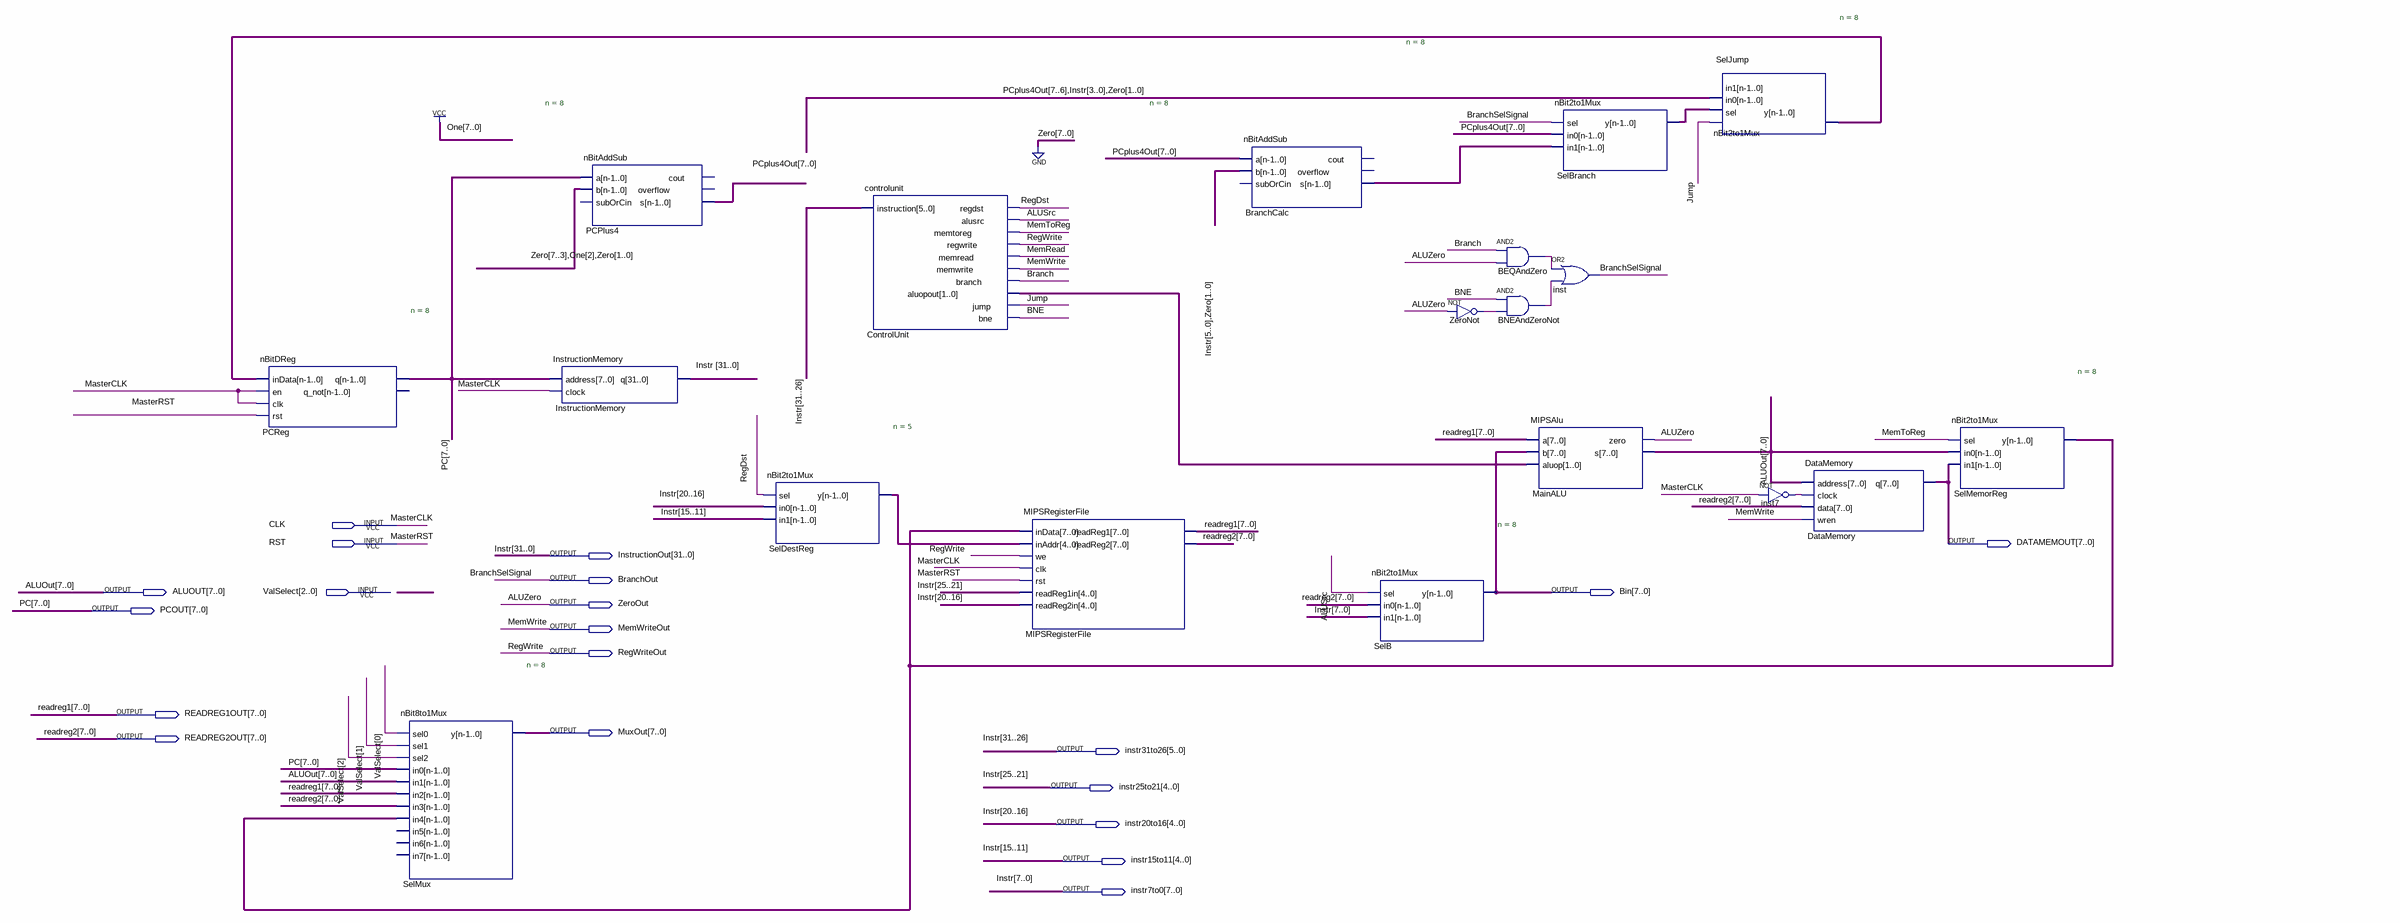
[diagram p0: schematic sheet]
// Quartus schematic TopLevelEntity.bdf as structural Verilog: 19 symbols, 20 pins
module TopLevelEntity (
  input  CLK,
  input  RST,
  input  [2:0] ValSelect,
  output [7:0] DATAMEMOUT,
  output [31:0] InstructionOut,
  output BranchOut,
  output [7:0] ALUOUT,
  output [7:0] Bin,
  output ZeroOut,
  output [7:0] PCOUT,
  output MemWriteOut,
  output RegWriteOut,
  output [7:0] READREG1OUT,
  output [7:0] MuxOut,
  output [7:0] READREG2OUT,
  output [5:0] instr31to26,
  output [4:0] instr25to21,
  output [4:0] instr20to16,
  output [4:0] instr15to11,
  output [7:0] instr7to0
);

  wire ALUSrc, BEQAndZero_out, BNE, BNEAndZeroNot_out, Branch, inst7_out, Jump, MemRead, MemToReg, RegDst,
       ZeroNot_out;
  wire [1:0] ControlUnit_aluopout;
  wire [4:0] SelDestReg_y;
  wire [7:0] BranchCalc_s, PCplus4Out, SelBranch_y, SelJump_y, SelMemorReg_y;

  nBitDReg #(.n(8)) PCReg (.inData(SelJump_y), .en(CLK), .clk(CLK), .rst(RST), .q(PCOUT));  // open: q_not
  nBit8to1Mux #(.n(8)) SelMux (
    .sel0(ValSelect[0]), .sel1(ValSelect[1]), .sel2(ValSelect[2]), .in0(PCOUT), .in1(ALUOUT),
    .in2(READREG1OUT), .in3(READREG2OUT), .in4(SelMemorReg_y), .y(MuxOut));  // open: in5, in6, in7
  InstructionMemory InstructionMemory (
    .address(PCOUT), .clock(CLK),
    .q({instr31to26, instr25to21, instr20to16, instr15to11, InstructionOut[10:8], instr7to0}));
  nBitAddSub #(.n(8)) PCPlus4 (.a(PCOUT), .b(8'b00000100), .s(PCplus4Out));  // open: subOrCin, cout, overflow
  nBit2to1Mux #(.n(5)) SelDestReg (.sel(RegDst), .in0(instr20to16), .in1(instr15to11), .y(SelDestReg_y));
  controlunit ControlUnit (
    .instruction(instr31to26), .regdst(RegDst), .alusrc(ALUSrc), .memtoreg(MemToReg), .regwrite(RegWriteOut),
    .memread(MemRead), .memwrite(MemWriteOut), .branch(Branch), .aluopout(ControlUnit_aluopout), .jump(Jump),
    .bne(BNE));
  MIPSRegisterFile MIPSRegisterFile (
    .inData(SelMemorReg_y), .inAddr(SelDestReg_y), .we(RegWriteOut), .clk(CLK), .rst(RST),
    .readReg1in(instr25to21), .readReg2in(instr20to16), .readReg1(READREG1OUT), .readReg2(READREG2OUT));
  nBitAddSub #(.n(8)) BranchCalc (
    .a(PCplus4Out), .b({instr7to0[5:0], 2'b00}), .s(BranchCalc_s));  // open: subOrCin, cout, overflow
  nBit2to1Mux #(.n(8)) SelB (.sel(ALUSrc), .in0(READREG2OUT), .in1(instr7to0), .y(Bin));
  not ZeroNot (ZeroNot_out, ZeroOut);
  and BEQAndZero (BEQAndZero_out, Branch, ZeroOut);
  and BNEAndZeroNot (BNEAndZeroNot_out, BNE, ZeroNot_out);
  MIPSAlu MainALU (.a(READREG1OUT), .b(Bin), .aluop(ControlUnit_aluopout), .zero(ZeroOut), .s(ALUOUT));
  nBit2to1Mux #(.n(8)) SelBranch (.sel(BranchOut), .in0(PCplus4Out), .in1(BranchCalc_s), .y(SelBranch_y));
  or inst (BranchOut, BEQAndZero_out, BNEAndZeroNot_out);
  nBit2to1Mux #(.n(8)) SelJump (
    .sel(Jump), .in0(SelBranch_y), .in1({PCplus4Out[7:6], instr7to0[3:0], 2'b00}), .y(SelJump_y));
  not inst7 (inst7_out, CLK);
  DataMemory DataMemory (.address(ALUOUT), .clock(inst7_out), .data(READREG2OUT), .wren(MemWriteOut), .q(DATAMEMOUT));
  nBit2to1Mux #(.n(8)) SelMemorReg (.sel(MemToReg), .in0(ALUOUT), .in1(DATAMEMOUT), .y(SelMemorReg_y));

  assign {InstructionOut[31:11], InstructionOut[7:0]} = {instr31to26, instr25to21, instr20to16, instr15to11, instr7to0};

  // Other names for the same wires on the sheet: ALUZero = ZeroOut; BranchSelSignal = BranchOut;
  //   Instr[31:0] = {instr31to26, instr25to21, instr20to16, instr15to11, InstructionOut[10:8], instr7to0};
  //   MasterCLK = CLK; MasterRST = RST; MemWrite = MemWriteOut; PC[7:0] = PCOUT; readreg1[7:0] = READREG1OUT;
  //   readreg2[7:0] = READREG2OUT; RegWrite = RegWriteOut
endmodule
